# Altium schematic sheet jumper24pin.schdoc
size 51 x 58 mm
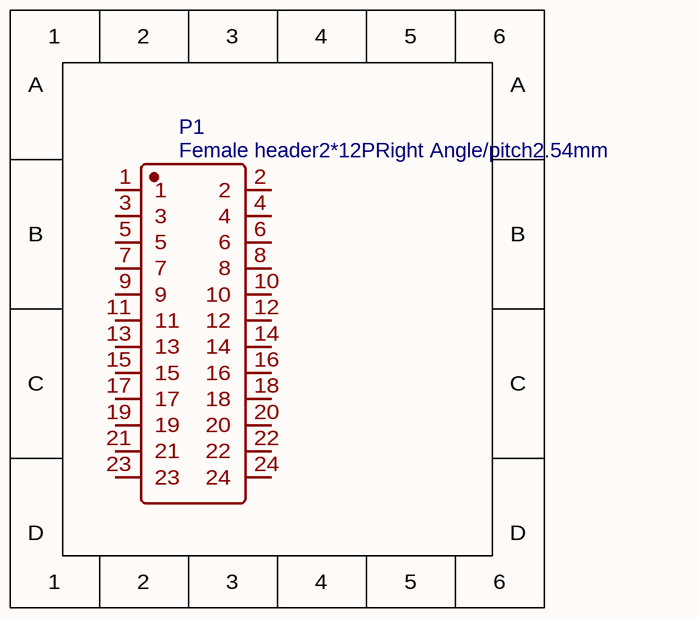
[diagram p0: jumper24pin.schdoc]

## Parts
P1  Female header2*12PRight Angle/pitch2.54mm  [HDR-TH_24P-P2.54-V-F-R2-C12-S2.54]

## Nets

Not connected (* = marked no-connect by the designer): P1 1 2 3 4 5 6 7 8 9 10 11 12 13 14 15 16 17 18 19 20 21 22 23 24

## Library data of the parts
P1 = Female header2*12PRight Angle/pitch2.54mm: BOM_Manufacturer: BOOMELE; BOM_Supplier: LCSC; BOM_Manufacturer Part: Female header2*12PRight Angle/pitch2.54mm; BOM_Supplier Part: C62744; BOM_JLCPCB Part Class: Extended Part; spicePre: P; spiceSymbolName: Female header2*12PRight Angle/pitch2.54mm